# EAGLE schematic TMP112_Breakout (EAGLE 6.5.0)
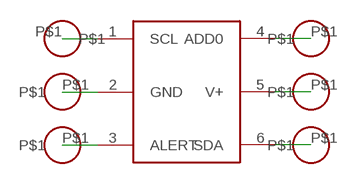
[diagram p0: schematic, sheet 1]

## Parts
U$1  TMP112  [TMP112]
U$2  VIA  [VIA]
U$3  VIA  [VIA]
U$4  VIA  [VIA]
U$5  VIA  [VIA]
U$6  VIA  [VIA]
U$7  VIA  [VIA]

## Nets
N$1: U$1.1(SCL) U$2.P$1
N$2: U$1.2(GND) U$3.P$1
N$3: U$1.3(ALERT) U$4.P$1
N$4: U$1.6(SDA) U$5.P$1
N$5: U$1.5(V+) U$6.P$1
N$6: U$1.4(ADD0) U$7.P$1

## Library data of the parts
U$1 = TMP112:TMP112: Tempsensor RS No: 709-8868 MRF No: TMP112AIDRLT
U$2-U$7 = via:VIA